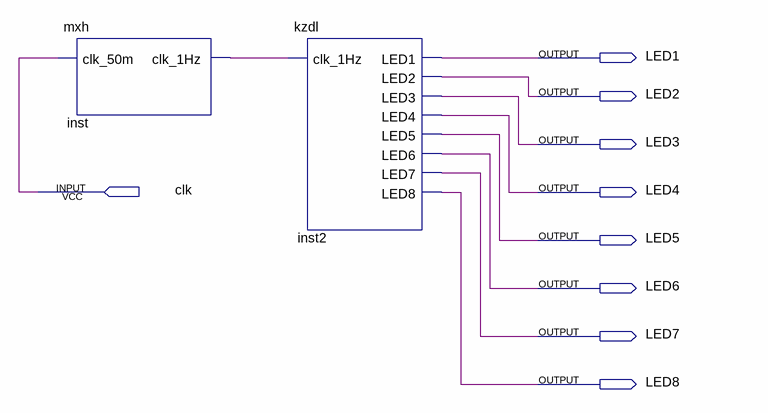
[diagram p0: schematic sheet]
// Quartus schematic LSD.bdf as structural Verilog: 2 symbols, 9 pins
module LSD (
  input  clk,
  output LED1,
  output LED2,
  output LED3,
  output LED4,
  output LED5,
  output LED6,
  output LED7,
  output LED8
);

  wire inst_clk_1hz;

  mxh inst (.clk_50m(clk), .clk_1Hz(inst_clk_1hz));
  kzdl inst2 (
    .clk_1Hz(inst_clk_1hz), .LED1(LED1), .LED2(LED2), .LED3(LED3), .LED4(LED4), .LED5(LED5), .LED6(LED6),
    .LED7(LED7), .LED8(LED8));
endmodule
